# Altium schematic sheet Chrono.SchDoc
size A4
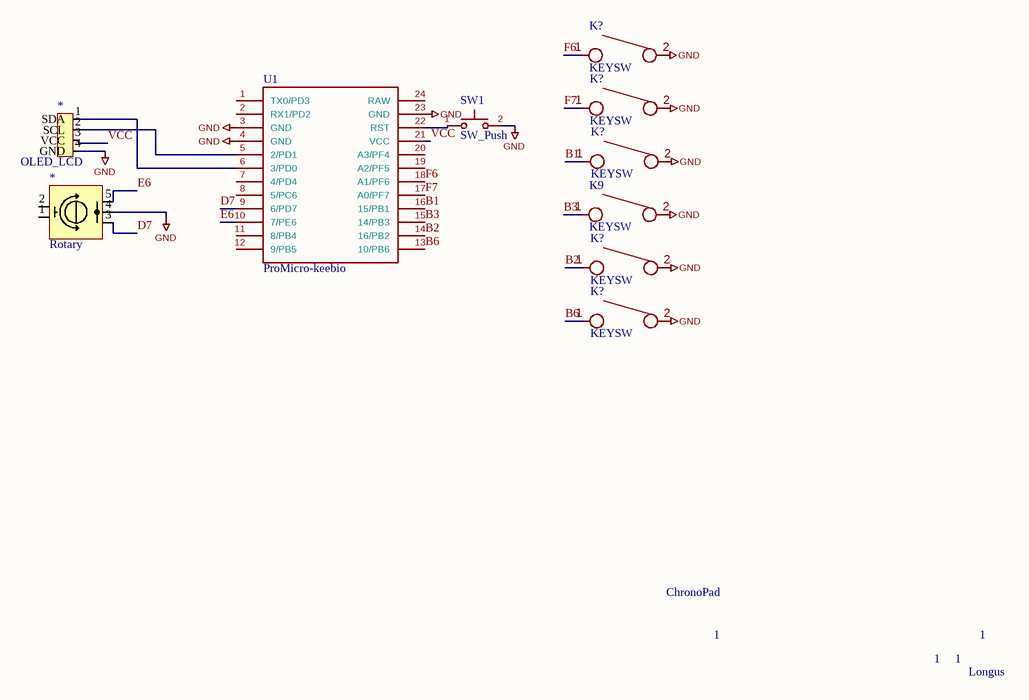
[diagram p0: Chrono.SchDoc]

## Parts
(Parts that share a designator on the sheet are numbered #1, #2 ... from top to bottom, then left to right.)
*#1  OLED_LCD
*#2  Rotary
K9  KEYSW  [Socket]
K?#1  KEYSW  [Socket]
K?#2  KEYSW  [Socket]
K?#3  KEYSW  [Socket]
K?#4  KEYSW  [Socket]
K?#5  KEYSW  [Socket]
SW1  SW_Push  [Reset]
U1  ProMicro-keebio  [Pro-Micro]

## Nets
GND: *#1.4(GND) *#2.4 K9.2 K?#1.2 K?#2.2 K?#3.2 K?#4.2 K?#5.2 SW1.2 U1.3(GND) U1.4(GND) U1.23(GND)
B1: K?#3.1 U1.16(15/PB1)
B2: K?#4.1 U1.14(16/PB2)
B3: K9.1 U1.15(14/PB3)
B6: K?#5.1 U1.13(10/PB6)
D7: *#2.3 U1.9(6/PD7)
E6: *#2.5 U1.10(7/PE6)
F6: K?#1.1 U1.18(A1/PF6)
F7: K?#2.1 U1.17(A0/PF7)
VCC: *#1.3(VCC) U1.21(VCC)
Net*#1_1: *#1.1(SDA) U1.6(3/PD0)
Net*#1_2: *#1.2(SCL) U1.5(2/PD1)
NetSW1_1: SW1.1 U1.22(RST)

Not connected (* = marked no-connect by the designer): *#2 1(S1) 2(S2); U1 1(TX0/PD3) 2(RX1/PD2) 7(4/PD4) 8(5/PC6) 11(8/PB4) 12(9/PB5) 19(A2/PF5) 20(A3/PF4) 24(RAW)

## Notes on the sheet
- ChronoPad
- 1
- 1     1
- Longus

## Library data of the parts
K9 K?#1-K?#5 = KEYSW-canadian_parts